# Altium schematic sheet Crystal.SchDoc
size A4; SheetNumber: 11; SheetTotal: 13
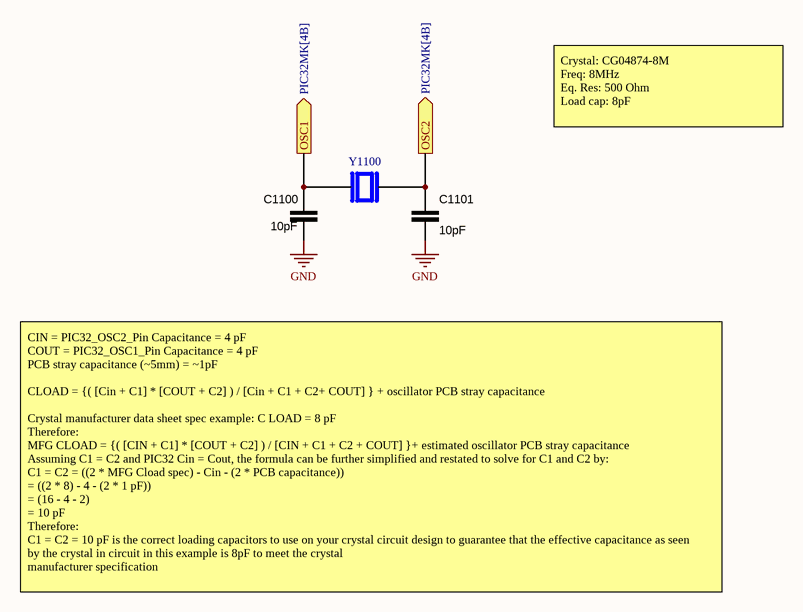
[diagram p0: Crystal.SchDoc]

## Parts
C1100  10pF  [CAP_0603]
C1101  10pF  [CAP_0603]
Y1100  CG04874-8M  [XTALDFN320X250X100-2N]  (value not drawn)

## Ports
OSC1 (out, see PIC32MK[4B]), OSC2 (out, see PIC32MK[4B])

## Nets
GND: C1100.2 C1101.2
OSC1: C1100.1 Y1100.1 ; port OSC1
OSC2: C1101.1 Y1100.2 ; port OSC2

## Notes on the sheet
- Crystal: CG04874-8M
  Freq: 8MHz
  Eq. Res: 500 Ohm
  Load cap: 8pF
- CIN = PIC32_OSC2_Pin Capacitance = 4 pF
  COUT = PIC32_OSC1_Pin Capacitance = 4 pF
  PCB stray capacitance (~5mm) = ~1pF
  CLOAD = {( [Cin + C1] * [COUT + C2] ) / [Cin + C1 + C2+ COUT] } + oscillator PCB stray capacitance
  Crystal manufacturer data sheet spec example: C LOAD = 8 pF
  Therefore:
  MFG CLOAD = {( [CIN + C1] * [COUT + C2] ) / [CIN + C1 + C2 + COUT] }+ estimated oscillator PCB stray capacitance
  Assuming C1 = C2 and PIC32 Cin = Cout, the formula can be further simplified and restated to solve for C1 and C2 by:
  C1 = C2 = ((2 * MFG Cload spec) - Cin - (2 * PCB capacitance))
  = ((2 * 8) - 4 - (2 * 1 pF))
  = (16 - 4 - 2)
  = 10 pF
  Therefore:
  C1 = C2 = 10 pF is the correct loading capacitors to use on your crystal circuit design to guarantee that the effective capacitance as seen
  by the crystal in circuit in this example is 8pF to meet the crystal
  manufacturer specification

## Library data of the parts
C1100 C1101 = C000007: CAP CER 10pF 0603 25V X7R; capaticanse: 100nf; ComponentLink1Description: digikey; ComponentLink1URL: https://www.digikey.com/en/products/detail/kyocera-avx/06033C104K4T2A/8019250
Y1100 = CG04874-8M: MF: {'manufacturer': u'NDK America, Inc.'}; Package: None; Price: None; Value: *; MP: CG04874-8M; Availability: Unavailable